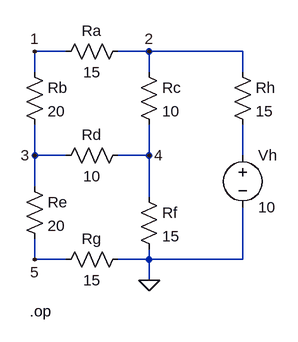
[diagram p0: schematic q1_circuit_6.asc]
q1_circuit_6.asc, the LTspice schematic file:
Version 4
SHEET 1 880 680
WIRE 144 -160 96 -160
WIRE 272 -160 224 -160
WIRE 416 -160 272 -160
WIRE 96 -128 96 -160
WIRE 272 -128 272 -160
WIRE 416 -128 416 -160
WIRE 96 0 96 -48
WIRE 144 0 96 0
WIRE 272 0 272 -48
WIRE 272 0 224 0
WIRE 416 0 416 -48
WIRE 96 48 96 0
WIRE 272 64 272 0
WIRE 96 160 96 128
WIRE 144 160 96 160
WIRE 272 160 272 144
WIRE 272 160 224 160
WIRE 416 160 416 80
WIRE 416 160 272 160
WIRE 272 192 272 160
FLAG 272 192 0
FLAG 96 -160 1
FLAG 272 -160 2
FLAG 96 0 3
FLAG 272 0 4
FLAG 96 160 5
SYMBOL res 256 -144 R0
SYMATTR InstName Rc
SYMATTR Value 10
SYMBOL res 80 -144 R0
SYMATTR InstName Rb
SYMATTR Value 20
SYMBOL res 240 -176 R90
WINDOW 0 0 56 VBottom 2
WINDOW 3 32 56 VTop 2
SYMATTR InstName Ra
SYMATTR Value 15
SYMBOL res 256 48 R0
SYMATTR InstName Rf
SYMATTR Value 15
SYMBOL res 240 144 R90
WINDOW 0 0 56 VBottom 2
WINDOW 3 32 56 VTop 2
SYMATTR InstName Rg
SYMATTR Value 15
SYMBOL res 80 32 R0
SYMATTR InstName Re
SYMATTR Value 20
SYMBOL voltage 416 -16 R0
SYMATTR InstName Vh
SYMATTR Value 10
SYMBOL res 240 -16 R90
WINDOW 0 0 56 VBottom 2
WINDOW 3 32 56 VTop 2
SYMATTR InstName Rd
SYMATTR Value 10
SYMBOL res 400 -144 R0
SYMATTR InstName Rh
SYMATTR Value 15
TEXT 88 240 Left 2 !.op

The netlist it stands for:
* q1_circuit_6.asc
Rc 2 4 10
Rb 1 3 20
Ra 2 1 15
Rf 4 0 15
Rg 0 5 15
Re 3 5 20
Vh N001 0 10
Rd 4 3 10
Rh 2 N001 15
.op
.backanno
.end